# Altium schematic sheet DCDC.SchDoc
size Letter; DocumentNumber: 2; SheetNumber: 2; SheetTotal: 7; DescLong2_DescShort: -
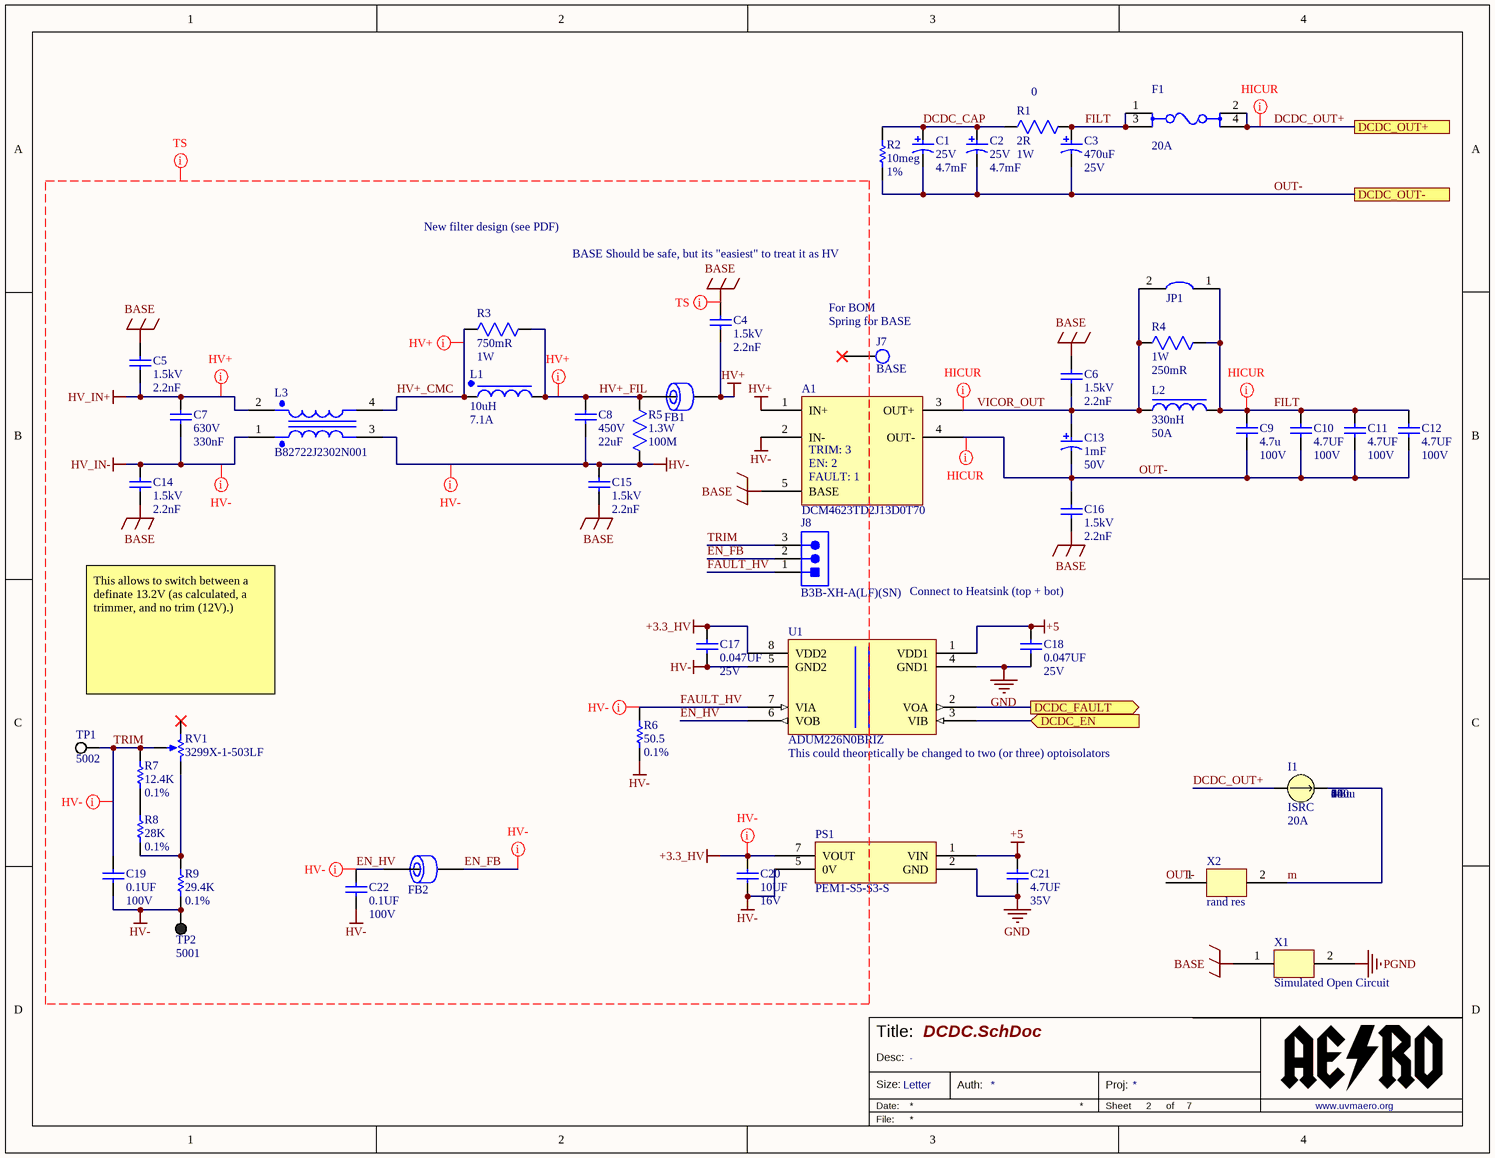
[diagram p0: DCDC.SchDoc]

## Parts
A1  VicorPN: DCM4623TD2J13D0T70  [VICOR_SOCKET_BUILT]  (hidden comment: VicorASM)
C1  Voltage Rating (DC): 25V  Capacitance: 4.7mF  [NICH_18X25]  (hidden comment: URS1E472MHD)
C2  Voltage Rating (DC): 25V  Capacitance: 4.7mF  [NICH_18X25]  (hidden comment: URS1E472MHD)
C3  Capacitance: 470uF  Voltage Rating (DC): 25V  [NICHICON_10X12.5]  (hidden comment: UVR1E471MPD1TD)
C4  Voltage Rating (DC): 1.5kV  Capacitance: 2.2nF  [B32021A3222K000]  (hidden comment: B32021A3222K000)
C5  Voltage Rating (DC): 1.5kV  Capacitance: 2.2nF  [B32021A3222K000]  (hidden comment: B32021A3222K000)
C6  Voltage Rating (DC): 1.5kV  Capacitance: 2.2nF  [B32021A3222K000]  (hidden comment: B32021A3222K000)
C7  Voltage: 630V  Capacitance: 330nF  [B32922C3334M000]  (hidden comment: B32922C3334M000)
C8  Voltage: 450V  Capacitance: 22uF  [B32774D]  (hidden comment: B32774D4226K000)
C9  Val: 4.7u  Vol: 100V  [1210_CAP_115H]  (hidden comment: CAP 1210 4.7UF 100V 20% X7S)
C10  Val: 4.7UF  Vol: 100V  [1210_CAP_115H]  (hidden comment: CAP 1210 4.7UF 100V 20% X7S)
C11  Val: 4.7UF  Vol: 100V  [1210_CAP_115H]  (hidden comment: CAP 1210 4.7UF 100V 20% X7S)
C12  Val: 4.7UF  Vol: 100V  [1210_CAP_115H]  (hidden comment: CAP 1210 4.7UF 100V 20% X7S)
C13  Capacitance: 1mF  Voltage Rating: 50V  [Nichicon_18x20]  (hidden comment: UHE1H102MHD3)
C14  Voltage Rating (DC): 1.5kV  Capacitance: 2.2nF  [B32021A3222K000]  (hidden comment: B32021A3222K000)
C15  Voltage Rating (DC): 1.5kV  Capacitance: 2.2nF  [B32021A3222K000]  (hidden comment: B32021A3222K000)
C16  Voltage Rating (DC): 1.5kV  Capacitance: 2.2nF  [B32021A3222K000]  (hidden comment: B32021A3222K000)
C17  Val: 0.047UF  Vol: 25V  [0603_CAP]  (hidden comment: CAP 0603 0.047UF 25V 10% X7R)
C18  Val: 0.047UF  Vol: 25V  [0603_CAP]  (hidden comment: CAP 0603 0.047UF 25V 10% X7R)
C19  Val: 0.1UF  Vol: 100V  [0805_CAP]  (hidden comment: CAP 0805 0.1UF 100V 10% X7R)
C20  Val: 10UF  Vol: 16V  [0603_CAP]  (hidden comment: CAP 0603 10UF 16V 20% X5R)
C21  Val: 4.7UF  Vol: 35V  [0603_CAP]  (hidden comment: CAP 0603 4.7UF 35V 10% X5R)
C22  Val: 0.1UF  Vol: 100V  [0805_CAP]  (hidden comment: CAP 0805 0.1UF 100V 10% X7R)
F1  FuseRating: 20A  [Keystone_3568_0]  (hidden comment: 3568)
FB1  FBMH4532HM681-T  [1812_FB]  (value not drawn)
FB2  Ferrite Chip 50 Ohms  [1206]  (value not drawn)
I1  ISRC  value 20A  AC Magnitude: 6  AC Phase: 15  DC Magnitude: 14  Pulsed Value: 20  Time Delay: 0  Rise Time: 6u  Fall Time: 0.3u  Pulse Width: 53u  Period: 100u  Phase: 4
J7  BASE  [KSTN240]  (mechanical)
J8  B3B-XH-A(LF)(SN)  [B3B-XH-A(LF)(SN)]
JP1  18AWG Link  [18AWG_1CM_LINK]  (value not drawn)
L1  Inductance: 10uH  Max DC Current: 7.1A  [WE-PD-XXL]  (hidden comment: 7447709100)
L2  Inductance: 330nH  Max DC Current: 50A  [WE-HCM 1390]  (hidden comment: 744309033)
L3  B82722J2302N001  [B82722J]
PS1  PEM1-S5-S3-S  [PEM1-S5-S3-S]
R1  value 0  Resistance: 2R  Power Rating: 1W  [RR01_VERT]  (hidden comment: RR01J2R0TB)
R2  Val: 10meg  Tol: 1%  [0603_RES]  (hidden comment: RES 0603 10M 1%)
R3  Resistance: 750mR  Power Rating: 1W  [RR01_VERT]  (hidden comment: RR01JR75TB)
R4  Power Rating: 1W  Resistance: 250mR  [WSLT2512]  (hidden comment: WSLT2512R2500FEB)
R5  value 100M  Power: 1.3W  [mur_MHR0422SA107F70]  (hidden comment: MHR0422SA107F70)
R6  Val: 50.5  Tol: 0.1%  [0805_RES]  (hidden comment: RES 0805 50.5 0.1%)
R7  Val: 12.4K  Tol: 0.1%  [0603_RES]  (hidden comment: RES 0603 12.4K 0.1%)
R8  Val: 28K  Tol: 0.1%  [0603_RES]  (hidden comment: RES 0603 28K 0.1%)
R9  Val: 29.4K  Tol: 0.1%  [0603_RES]  (hidden comment: RES 0603 29.4K 0.1%)
RV1  3299X-1-503LF  [3296Z]
TP1  5002  [KSTN-5002]
TP2  5001  [KSTN-5001]
U1  ADUM226N0BRIZ  [ADUM226N0BRIZ]
X1  Simulated Open Circuit
X2  rand res

## Ports
DCDC_EN (in), DCDC_FAULT (out), DCDC_OUT+, DCDC_OUT-

## Nets
+3.3_HV: C17.2 C20.2 PS1.7(VOUT) U1.8(VDD2)
+5: C18.2 C21.2 PS1.1(VIN) U1.1(VDD1)
BASE: A1.5(BASE) C4.2 C5.2 C6.2 C14.1 C15.1 C16.1 X1.1
GND: C18.1 C21.1 PS1.2(GND) U1.4(GND1)
HV+: A1.1(IN+) C4.1 FB1.2
HV-: A1.2(IN-) C8.1 C15.2 C17.1 C19.2 C20.1 C22.2 L3.3 PS1.5(0V) R5.1 R6.1 R9.1 TP2.1 U1.5(GND2)
HV_IN+: C5.1 C7.2 L3.2
HV_IN-: C7.1 C14.2 L3.1
PGND: X1.2
DCDC_CAP: C1.1 C2.1 R1.2 R2.2
DCDC_EN: U1.3(VIB) ; port DCDC_EN
DCDC_FAULT: U1.2(VOA) ; port DCDC_FAULT
DCDC_OUT+: F1.2 F1.4 I1.1 ; port DCDC_OUT+
EN_FB: FB2.2 J8.2
EN_HV: C22.1 FB2.1 U1.6(VOB)
FAULT_HV: J8.1 R6.2 U1.7(VIA)
FILT: C3.1 C9.2 C10.2 C11.2 C12.2 F1.1 F1.3 JP1.1 L2.2 R1.1 R4.2
HV+_CMC: L1.1 L3.4 R3.1
HV+_FIL: C8.2 FB1.1 L1.2 R3.2 R5.2
m: I1.2 X2.2
OUT-: A1.4(OUT-) C1.2 C2.2 C3.2 C9.1 C10.1 C11.1 C12.1 C13.2 C16.2 R2.1 X2.1 ; port DCDC_OUT-
TRIM: C19.1 J8.3 R7.2 RV1.2(WIPER) TP1.1
VICOR_OUT: A1.3(OUT+) C6.1 C13.1 JP1.2 L2.1 R4.1
NetR7_1: R7.1 R8.2
NetR8_1: R8.1 R9.2 RV1.1(CCW)

Not connected (* = marked no-connect by the designer): J7 1*; RV1 3(CW)*

## Layout directives
net class TS_H: HV+_CMC, HV+_FIL, HV_IN+
net class TS_L: +3.3_HV, EN_FB, EN_HV, FAULT_HV, HV-, HV_IN-, TRIM
net class TS: +3.3_HV, BASE, EN_FB, EN_HV, FAULT_HV, HV+, HV+_CMC, HV+_FIL, HV-, HV_IN+, HV_IN-, TRIM
net class HICUR: DCDC_OUT+, FILT, OUT-, VICOR_OUT

## Notes on the sheet
- New filter design (see PDF)
- BASE Should be safe, but its "easiest" to treat it as HV
- (near J7) For BOM
- (near J7) Spring for BASE
- Connect to Heatsink (top + bot)
- This allows to switch between a definate 13.2V (as calculated, a trimmer, and no trim (12V).)
- (near U1) This could theoretically be changed to two (or three) optoisolators
- Title:
- Size:
- Date:
- Desc:
- Letter
- Auth:
- Sheet
- Proj:
- *
- of
- www.uvmaero.org
- File:
- (in symbol VicorASM_ALT) TRIM: 3; EN: 2; FAULT: 1

## Library data of the parts
A1 = VicorASM_ALT: DCM4623TD2J13D0T70 PCB Assembly / Keystone 240 for BASE (also order KSTN241) / Do a full subassembly bom check; ComponentLink1Description: Datasheet; ComponentLink1URL: http://www.vicorpower.com/documents/datasheets/DCM4623xD2J13D0y7z_ds.pdf
C1 C2 = URS1E472MHD: 4700µF 25V Aluminum Electrolytic Capacitors Radial, Can  2000 Hrs @ 85°C; Manufacturer: Nichicon; Dielectric Material: Aluminium; Dissipation Factor: 0.16%; Leakage Current: 3.525mA; Life (Hours): 2000Hour; Ripple Current: 2.05A; Tolerance: 20%; Value: 0.0047; ComponentLink1Description: Manufacturer URL; ComponentLink2Description: Datasheet; ComponentLink2URL: http://products.nichicon.co.jp/en/pdf/XJA043/e-ud.pdf; ComponentLink3URL: http://products.nichicon.co.jp/en/pdf/XJA043/e-ud.pdf; ComponentLink3Description: Package Specification; ComponentLink1URL: http://www.nichicon.co.jp/; Case/Package: Radial; Category: Aluminum Electrolytic Capacitors; Diameter: 18mm; Height: 25mm; Height - Seated (Max): 1.043inch; Lead Free: Lead Free; Lead Pitch: 7.5mm; Length: 25mm; Manufacturer Part Number: URS1E472MHD; Max Operating Temperature: 85°C; Min Operating Temperature: -40°C; Mount: Through Hole; Number of Pins: 2; Package Quantity: 50; Packaging: Bulk; Radiation Hardening: No; REACH SVHC: No SVHC; Termination: Radial; Voltage Rating: 25V; Supplier 1: Digi-Key; Supplier Part Number 1: 493-15905-ND
C3 = UVR1E471MPD1TD: 470µF 25V Aluminum Electrolytic Capacitors Radial, Can  2000 Hrs @ 85°C; Manufacturer: Nichicon; Dissipation Factor: 0.16%; Lead Diameter: 0.6mm; Leakage Current: 352.5uA; Life (Hours): 2000Hour; Ripple Current: 550mA; Tolerance: 20%; ComponentLink1Description: Manufacturer URL; ComponentLink2Description: Datasheet; ComponentLink2URL: http://products.nichicon.co.jp/en/pdf/XJA043/e-ud.pdf; ComponentLink3URL: http://products.nichicon.co.jp/en/pdf/XJA043/e-ud.pdf; ComponentLink3Description: Package Specification; ComponentLink1URL: http://www.nichicon.co.jp/; Case/Package: Radial; Category: Aluminum Electrolytic Capacitors; Diameter: 10mm; Height: 12.5mm; Height - Seated (Max): 0.551inch; Lead Pitch: 5mm; Length: 12.5mm; Manufacturer Part Number: UVR1E471MPD1TD; Max Operating Temperature: 85°C; Min Operating Temperature: -40°C; Mount: Through Hole,PCB; Package Quantity: 500; Packaging: Tape and Reel; Radiation Hardening: No; REACH SVHC: No SVHC; Termination: Radial; Voltage: 25V; Voltage Rating: 25V; Supplier 1: Digi-Key; Supplier Part Number 1: UVR1E471MPD1TD-ND
C4-C6 C14-C16 = B32021A3222K000: 2200pF Film Capacitor 300V 1500V (1.5kV) Polypropylene (PP), Metallized Radial; Manufacturer: TDK EPCOS; Lead Diameter: 0.6mm; Lead/Base Style: Straight; Tolerance: 10%; ComponentLink1Description: Datasheet; ComponentLink1URL: http://en.tdk.eu/inf/20/20/db/fc_2009/Y2_B32021_026.pdf; Case/Package: Radial; Category: Film Capacitors; Depth: 4mm; Dielectric: PP; Height: 9mm; Lead Pitch: 10mm; Length: 13mm; Manufacturer Part Number: B32021A3222K000; Max Operating Temperature: 110°C; Min Operating Temperature: -40°C; Number of Pins: 2; Package Quantity: 1000; Packaging: Bulk; Termination: Radial; Voltage Rating (AC): 300V; Width: 4mm
C7 = B32922C3334M000: 0.33µF Film Capacitor 305V 630V Polypropylene (PP) Radial; Manufacturer: TDK EPCOS; Lead Diameter: 0.8mm; Tolerance: 20%; ComponentLink1Description: Datasheet; ComponentLink1URL: http://en.tdk.eu/inf/20/20/db/fc_2009/Y2_B32021_026.pdf; Supplier 1: Digi-Key; Case/Package: Radial; Category: Film Capacitors; Contact Plating: Tin,Matte; Depth: 8mm; Dielectric: PP; Dielectric Material: Polypropylene; Lead Pitch: 15mm; Length: 18mm; Manufacturer Part Number: B32922C3334M000; Max Operating Temperature: 105°C; Min Operating Temperature: -40°C; Mount: Through Hole; Number of Pins: 2; Packaging: Bulk; Radiation Hardening: No; REACH SVHC: No SVHC; Termination: Radial; Voltage Rating (AC): 305V; Width: 18mm; Supplier Part Number 1: 495-2321-ND
C8 = B32774D4226K000: 22µF Film Capacitor  450V Polypropylene (PP), Metallized Radial; Manufacturer: TDK EPCOS; ESR (Equivalent Series Resistance): 5.4mR; Lead Diameter: 0.8mm; Lead Length: 6mm; Tolerance: 10%; Category: Film Capacitors; Contact Plating: Tin,Matte; Depth: 22mm; Dielectric: PP; Dielectric Material: PP; Height: 36.5mm; Lead Pitch: 27.5mm; Length: 31.5mm; Manufacturer Part Number: B32774D4226K000; Max Operating Temperature: 105°C; Min Operating Temperature: -40°C; Mount: Through Hole; Packaging: Bulk; REACH SVHC: No SVHC; Termination: Radial; Voltage Rating: 450V; Voltage Rating (DC): 450V; Supplier 1: Digi-Key; Supplier Part Number 1: 495-3942-ND
C9 = CAP 1210 4.7UF 100V 20% X7S: Capacitor Surface Mount 1210 Footprint 4.7UF 100V 20% Tolerance Ceramic X7S; Manufacturer: Various; PCB Package: 1210; Description in Visual: Cap SMT 1210 4.7UF 100V 20%  Cer X7S; Value: 4.7u; P/N: CAP 1210 4.7UF 100V 20% X7S; Manufacturer P/N: Various; Voltage: 100V; Tolerance: 20%; Type: Ceramic X7S; ComponentLink1Description: Manufacturer Website; ComponentLink2Description: Component Datasheet; ComponentLink3Description: Octopart Link
C10-C12 = CAP 1210 4.7UF 100V 20% X7S: Capacitor Surface Mount 1210 Footprint 4.7UF 100V 20% Tolerance Ceramic X7S; Manufacturer: Various; PCB Package: 1210; Description in Visual: Cap SMT 1210 4.7UF 100V 20%  Cer X7S; P/N: CAP 1210 4.7UF 100V 20% X7S; Manufacturer P/N: Various; Value: 4.7UF; Voltage: 100V; Tolerance: 20%; Type: Ceramic X7S; ComponentLink1Description: Manufacturer Website; ComponentLink2Description: Component Datasheet; ComponentLink3Description: Octopart Link
C13 = UHE1H102MHD3: 1000µF 50V Aluminum Electrolytic Capacitors Radial, Can  10000 Hrs @ 105°C; Manufacturer: Nichicon; Dielectric Material: Aluminium; Dissipation Factor: 0.1%; ESR (Equivalent Series Resistance): 97mR; Impedance: 36mR; Lead Diameter: 0.8mm; Leakage Current: 500uA; Life (Hours): 10000Hour; Ripple Current: 2.49A; Tolerance: 20%; Value: 1m; Voltage Rating (DC): 50V; Case/Package: Radial; Category: Aluminum Electrolytic Capacitors; Diameter: 18mm; Height: 20mm; Height - Seated (Max): 0.787inch; Lead Free: Lead Free; Lead Pitch: 7.5mm; Length: 20mm; Manufacturer Part Number: UHE1H102MHD3; Max Operating Temperature: 105°C; Min Operating Temperature: -40°C; Mount: Through Hole; Package Quantity: 50; Packaging: Bulk; Radiation Hardening: No; REACH SVHC: No SVHC; Termination: Radial; Supplier 1: Digi-Key; Supplier Part Number 1: 493-1623-ND
C17 C18 = CAP 0603 0.047UF 25V 10% X7R: Capacitor Surface Mount 0603 Footprint 0.047UF 25V 10% Tolerance Ceramic X7R; Manufacturer: Various; PCB Package: 0603; Description in Visual: Cap SMT 0603 0.047UF 25V 10%  Cer X7R; P/N: CAP 0603 0.047UF 25V 10% X7R; Manufacturer P/N: Various; Value: 0.047UF; Voltage: 25V; Tolerance: 10%; Type: Ceramic X7R; ComponentLink1Description: Manufacturer Website; ComponentLink2Description: Component Datasheet; ComponentLink3Description: Octopart Link
C19 C22 = CAP 0805 0.1UF 100V 10% X7R: Capacitor Surface Mount 0805 Footprint 0.1UF 100V 10% Tolerance Ceramic X7R; Manufacturer: Various; PCB Package: 0805; Description in Visual: Cap SMT 0805 0.1UF 100V 10%  Cer X7R; P/N: CAP 0805 0.1UF 100V 10% X7R; Manufacturer P/N: Various; Value: 0.1UF; Voltage: 100V; Tolerance: 10%; Type: Ceramic X7R; ComponentLink1Description: Manufacturer Website; ComponentLink2Description: Component Datasheet; ComponentLink3Description: Octopart Link
C20 = CAP 0603 10UF 16V 20% X5R: Capacitor Surface Mount 0603 Footprint 10UF 16V 20% Tolerance Ceramic X5R; Manufacturer: Various; PCB Package: 0603; Description in Visual: Cap SMT 0603 10UF 16V 20% Ceramic X5R; P/N: CAP 0603 10UF 16V 20% X5R; Manufacturer P/N: Various; Value: 10UF; Voltage: 16V; Tolerance: 20%; Type: Ceramic X5R; ComponentLink1Description: Manufacturer Website; ComponentLink2Description: Component Datasheet; ComponentLink3Description: Octopart Link
C21 = CAP 0603 4.7UF 35V 10% X5R: Capacitor Surface Mount 0603 Footprint 47UF 35V 10% Tolerance Ceramic X5R; Manufacturer: Various; PCB Package: 0603; P/N: CAP 0603 4.7UF 35V 10% X5R; Manufacturer P/N: Various; Description in Visual: CAP 0603 4.7UF 35V 10% X5R; Value: 4.7UF; Voltage: 35V; Tolerance: 10%; Type: Ceramic X5R; ComponentLink1Description: Manufacturer Website; ComponentLink2Description: Component Datasheet; ComponentLink3Description: Octopart Link
F1 = 3568: Fuse Holder 30A 500V 1 Circuit Blade Through Hole; Manufacturer: Keystone Electronics; Approvals: UL; Body Material: Nylon; Color: Black; Fuse Type: Automotive; Illumination Type: Illuminated; Material: Brass,Tin,Nylon; Number of Circuits: 1; Value: 0.00321; Category: Fuse Holders; Contact Material: Brass,Tin; Contact Plating: Tin; Current Rating: 20A; Depth: 6.73mm; Flammability Rating: UL94 V-0; Fuse Current: 20A; Lead Free: Lead Free; Length: 16mm; Manufacturer Part Number: 3568; Max Operating Temperature: 145°C; Min Operating Temperature: -50°C; Mount: PCB,Vertical; Number of Poles: 1; Orientation: Vertical; Package Quantity: 1; REACH SVHC: No SVHC; Termination: PC Pin; Voltage: 500V; Voltage Rating (AC): 500V; Supplier 1: Digi-Key; Supplier Part Number 1: 36-3568-ND
FB1 = FBMH4532HM681-T: Ferrite Chip 4000 mA 680 Ohms Differential Mode - Single 1812 Footprint; Manufacturer: Taiyo Yuden; Description in Visual: Ferrite SMT 4000mA 680Ohm Dif Mode 1812; Usage: Power Supply; Current (mA): 5000; Frequency: 100 MHz; Impedance at Freq (ohms): 30; DC Resistance (ohms): 0.028; PCB Package: 1812; P/N: FBMH4532HM681-T; Manufacturer P/N: FBMH4532HM681-T; Filter type: Differential Mode - Single; Operating Temperature Range: -40 to +125 °C; ComponentLink1Description: Manufacturer Website; ComponentLink1URL: #http://www.yuden.co.jp#; ComponentLink2Description: Component Datasheet; ComponentLink2URL: #https://ds.yuden.co.jp/TYCOMPAS/ut/detail?pn=FBMH4532HM681-T%20%20&u=M#; ComponentLink3Description: Octopart Link; ComponentLink3URL: #https://octopart.com/search?q=FBMH4532HM681-T&currency=USD&specs=0#
FB2 = 742792114: Ferrite Chip 3000 mA 50 Ohms Differential Mode - Single 1206 Footprint; Manufacturer: Wurth Electronics; Description in Visual: Ferrite SMT 3000mA 50Ohm Dif Mode 1206; Usage: Power Supply; Current (mA): 3000; Frequency: 100 MHz; Impedance at Freq (ohms): 50; DC Resistance (ohms): 0.02; P/N: 742792114; Manufacturer P/N: 742792114; Filter type: Differential Mode - Single; Operating Temperature Range: -55 to +125 °C; PCB Package: 1206; ComponentLink1Description: Manufacturer Website; ComponentLink1URL: http://www.we-online.com; ComponentLink2Description: Component Datasheet; ComponentLink2URL: http://www.we-online.com/eisos/pdf/742792114.pdf; ComponentLink3Description: Octopart Link; ComponentLink3URL: http://octopart.com/partsearch/#search/requestData&q=742792114
I1 = ISRC: Current Source; Note: PCB Footprint - Not required; Published: 8-Jun-2000; LatestRevisionDate: 17-Jul-2002; LatestRevisionNote: Re-released for DXP Platform.; PackageReference: Not Applicable; Publisher: Altium Limited; Initial Value: 14
J7 = 240: Battery Contact Spring (Coil) AA 1 Cell PC Pin; Supplier 1: Digi-Key; Supplier Part Number 1: 36-240-ND
J8 = B3B-XH-A(LF)(SN): Connector Header Through Hole 3 position 0.098" (2.50mm); Manufacturer: JST; Wire/Cable Gauge: 22AWG; Connector Type: Male Pin; Contact Resistance: 20mR; Current Rating: 3A; Gender: Male; Insulation Resistance: 1GR; Max Voltage Rating (AC): 250V; Number of Contacts: 3; Pitch: 2.5mm; Category: Headers and Wire Housings; Color: Natural; Contact Material: Brass; Contact Plating: Tin,Lead,Copper; Depth: 5.75mm; Fastening Type: Detent; Housing Color: White; Housing Material: Polyamide; Lead Free: Lead Free; Lead Pitch: 2.5mm; Length: 9.9mm; Manufacturer Part Number: B3B-XH-A(LF)(SN); Max Current Rating: 3A; Max Operating Temperature: 85°C; Max Voltage Rating (DC): 250V; Min Operating Temperature: -25°C; Mount: Through Hole; Number of Positions: 3; Number of Rows: 1; Orientation: Straight; Packaging: Bulk; REACH SVHC: No SVHC; Termination: Press-Fit; Voltage Rating: 250V; Voltage Rating (AC): 250V; Supplier 1: Newark; Supplier Part Number 1: 73M9431
JP1 = JP_18AWG: 18AWG Jumper link, 1CM
L1 = 7447709100: 10µH Shielded Wirewound Inductor 7.1A 21mOhm Max Nonstandard; Manufacturer: Wurth Electronics; Core Material: Ferrite; DC Resistance (DCR): 21mR; Inductance Tolerance: 20%; Saturation Current: 10.5A; Self Resonant Frequency: 21MHz; Test Frequency: 1kHz; Case Code (Imperial): 1210; Case Code (Metric): 3225; Case/Package: Nonstandard; Category: Fixed Inductors; Composition: Wirewound; Current Rating: 7.1A; Depth: 12mm; Height: 10mm; Height - Seated (Max): 0.394inch; Lead Free: Lead Free; Lead Pitch: 7mm; Length: 12mm; Manufacturer Part Number: 7447709100; Max Operating Temperature: 125°C; Min Operating Temperature: -40°C; Mount: Surface Mount; Number of Pins: 2; Package Quantity: 250; Packaging: Cut Tape; REACH SVHC: Unknown; Resistance: 21mR; RMS Current (Irms): 7.1A; Series Resistance: 21mR; Shielding: Shielded; Termination: SMD/SMT; Tolerance: 20%; Weight: 0.01lb; Width: 12mm; Supplier 1: Digi-Key; Supplier Part Number 1: 732-1241-1-ND
L2 = 744309033: 330nH Shielded Wirewound Inductor 47.5A 0.165mOhm Nonstandard; Manufacturer: Wurth Electronics; Core Material: Zinc; DC Resistance (DCR): 0.165mR; Inductance Tolerance: 20%; Saturation Current: 62.5A; Self Resonant Frequency: 158MHz; Test Frequency: 100kHz; Width: 0.512inch; Case/Package: Nonstandard; Category: Fixed Inductors; Composition: Wirewound; Current Rating: 47.5A; Height: 9mm; Height - Seated (Max): 0.374inch; Lead Free: Lead Free; Length: 0.551inch; Manufacturer Part Number: 744309033; Max Operating Temperature: 125°C; Min Operating Temperature: -40°C; Mount: Surface Mount; Package Quantity: 300; Packaging: Tape and Reel; REACH SVHC: Unknown; RMS Current (Irms): 50A; Shielding: Shielded; Termination: SMD/SMT; Tolerance: 20%; Supplier 1: Allied Electronics; Supplier Part Number 1: 71071222
L3 = B82722J2302N001: 1.2mH @ 10kHz 2 Line Common Mode Choke Through Hole  3A DCR 56mOhm (Typ); Manufacturer: TDK EPCOS; Approvals: VDE,UR,ENEC; Core Material: Ferrite; DC Resistance (DCR): 56R; Inductance Tolerance: 30%; Lead/Base Style: Pin; Number of Lines: 2; Row Spacing: 12.5mm; Series Resistance: 56mR; Shielding: Unshielded; Voltage Rating (AC): 250V; Case/Package: Radial; Category: Common Mode Chokes; Contact Plating: Tin; Current Rating: 3A; DC Current: 3A; Depth: 16.1mm; Flammability Rating: UL94 V-0; Height: 25.4mm; Inductance: 1.2mH; Lead Free: Lead Free; Lead Pitch: 10mm; Length: 23.3mm; Manufacturer Part Number: B82722J2302N001; Max Current Rating: 3A; Max DC Current: 3A; Max Operating Temperature: 125°C; Military Standard: Not; Min Operating Temperature: -40°C; Mount: Through Hole; Number of Pins: 4; Package Quantity: 540; Packaging: Box; Radiation Hardening: No; REACH SVHC: No SVHC; Termination: Radial; Test Frequency: 10kHz; Tolerance: 30%; Weight: 0.35274oz; Width: 16.1mm; Supplier 1: Digi-Key; Supplier Part Number 1: 495-2748-ND
PS1 = PEM1-S5-S3-S: Isolated Module DC DC Converter 1 Output 3.3V    303mA 4.5V - 5.5V Input; Manufacturer: CUI; Efficiency: 75%; Isolation Voltage: 3kV; Max Power Dissipation: 1W; Number of Outputs: 1; Case/Package: SIP; Category: Board Mount Modules; Features: OVP,OCP,OTP,SCP; Height: 0.37inch; Lead Free: Lead Free; Length: 0.77inch; Manufacturer Part Number: PEM1-S5-S3-S; Max Input Voltage: 5.5V; Max Operating Temperature: 105°C; Max Output Current: 303mA; Min Input Voltage: 4.5V; Min Operating Temperature: -40°C; Mount: Through Hole; Packaging: Rail/Tube; Voltage - Output 1: 3.3V; Width: 0.24inch; Supplier 1: Digi-Key; Supplier Part Number 1: 102-3663-ND
R1 = RR01J2R0TB: 2 Ohms ±5% 1W Through Hole Resistor Axial Flame Retardant Coating, Pulse Withstanding, Safety Metal Film; Manufacturer: TE Connectivity Holsworthy; Manufacturer Part Number: RR01JR75TB; Voltage Rating: 350V; Number of Resistors: 1; Temperature Coefficient: 300ppm/°C; Case/Package: Axial; Category: Through-Hole Resistors; Composition: Power resistor; Diameter: 2.6mm; ELV: Compliant; Length: 6.8mm; Max Operating Temperature: 155°C; Min Operating Temperature: -55°C; Mount: Axial; Number of Terminations: 2; Package Quantity: 5000; Packaging: Ammo Pack; Termination: Axial; Tolerance: 5%; Supplier 1: Digi-Key; Supplier Part Number 1: A138161CT-ND
R2 = RES 0603 10M 1%: Resistor Surface Mount, 10M Ohms, 0603 Footprint, 1% Tolerance 0.1W; Manufacturer: Various; PCB Package: 0603; Description in Visual: Res SMT 10M 0603  1%  0.1W; Value: 10meg; P/N: RES 0603 10M 1%; Manufacturer P/N: Various; Power_Rating: 0.1W; Tolerance: 1%
R3 = RR01JR75TB: 750 mOhms ±5% 1W Through Hole Resistor Axial Flame Retardant Coating, Pulse Withstanding, Safety Metal Film; Manufacturer: TE Connectivity Holsworthy; Voltage Rating: 350V; Number of Resistors: 1; Temperature Coefficient: 300ppm/°C; Case/Package: Axial; Category: Through-Hole Resistors; Composition: Power resistor; Diameter: 2.6mm; ELV: Compliant; Length: 6.8mm; Manufacturer Part Number: RR01JR75TB; Max Operating Temperature: 155°C; Min Operating Temperature: -55°C; Mount: Axial; Number of Terminations: 2; Package Quantity: 5000; Packaging: Ammo Pack; Termination: Axial; Tolerance: 5%; Supplier 1: Digi-Key; Supplier Part Number 1: A138247CT-ND
R4 = WSLT2512R2500FEB: 250 mOhms ±1% 1W Chip Resistor 2512 (6432 Metric) Anti-Sulfur, Automotive AEC-Q200, Current Sense, Moisture Resistant, Pulse Withstanding Metal Element; Manufacturer: Vishay Dale; Temperature Coefficient: 75ppm/°C; Case Code (Imperial): 2512; Case Code (Metric): 6432; Case/Package: 2512; Category: Chip SMD Resistors; Composition: Metal Element; Features: Moisture Resistant; Height: 0.035inch; Length: 0.25inch; Manufacturer Part Number: WSLT2512R2500FEB; Max Operating Temperature: 275°C; Max Power Dissipation: 1W; Min Operating Temperature: -65°C; Number of Terminations: 2; Package Quantity: 1; Packaging: Tape and Reel; Termination: SMD/SMT; Tolerance: 1%; Weight: 0.001429oz; Width: 0.125inch; Supplier 1: Digi-Key; Supplier Part Number 1: WSLTB-.250CT-ND
R5 = MHR0422SA107F70: 100 MOhms ±1% 1.3W Through Hole Resistor Radial High Voltage Thick Film; Manufacturer: Murata; Manufacturer Part Number: MHR0422SA107F70; Supplier 1: Digi-Key; Supplier Part Number 1: 490-18226-ND
R6 = RES 0805 50.5 0.1%: Resistor Surface Mount, 50.5 Ohms, 0805 Footprint, 0.1% Tolerance 0.125W; Manufacturer: Various; PCB Package: 0805; Description in Visual: Res SMT 50.5 0805  0.1%  0.125W; Value: 50.5; P/N: RES 0805 50.5 0.1%; Manufacturer P/N: Various; Power_Rating: 0.125W; Tolerance: 0.1%
R7 = RES 0603 12.4K 0.1%: Resistor Surface Mount, 12.4K Ohms, 0603 Footprint, 0.1% Tolerance 0.1W; Manufacturer: Various; PCB Package: 0603; Description in Visual: Res SMT 12.4K 0603  0.1%  0.1W; P/N: RES 0603 12.4K 0.1%; Manufacturer P/N: Various; Value: 12.4K; Power_Rating: 0.1W; Tolerance: 0.1%
R8 = RES 0603 28K 0.1%: Resistor Surface Mount, 28K Ohms, 0603 Footprint, 0.1% Tolerance 0.1W; Manufacturer: Various; PCB Package: 0603; Description in Visual: Res SMT 28K 0603  0.1%  0.1W; P/N: RES 0603 28K 0.1%; Manufacturer P/N: Various; Value: 28K; Power_Rating: 0.1W; Tolerance: 0.1%
R9 = RES 0603 29.4K 0.1%: Resistor Surface Mount, 29.4K Ohms, 0603 Footprint, 0.1% Tolerance 0.1W; Manufacturer: Various; PCB Package: 0603; Description in Visual: Res SMT 29.4K 0603  0.1%  0.1W; P/N: RES 0603 29.4K 0.1%; Manufacturer P/N: Various; Value: 29.4K; Power_Rating: 0.1W; Tolerance: 0.1%
RV1 = 3299X-1-503LF: 50 kOhms 0.5W, 1/2W PC Pins Through Hole Trimmer Potentiometer Cermet 25 Turn Side Adjustment; Manufacturer: Bourns; Max Power Dissipation: 500mW; Number of Turns: 25; Resistance: 50kR; Temperature Coefficient: 100ppm/°C; Tolerance: 10%; Voltage Rating: 300V; Voltage Rating (DC): 500V; Category: Variable Resistors and Potentiometers; Color: Blue; Composition: Cermet; Depth: 6.1mm; Height: 0.375inch; Lead Free: Lead Free; Length: 11.05mm; Manufacturer Part Number: 3299X-1-503LF; Max Operating Temperature: 125°C; Military Standard: Not; Min Operating Temperature: -55°C; Mount: Panel,Through Hole,PCB; Package Quantity: 50; Packaging: Rail/Tube; Power Rating: 500mW; Radiation Hardening: No; REACH SVHC: No SVHC; Taper: Linear; Termination: Pin; Weight: 0.035oz; Width: 9.53mm; Supplier 1: Digi-Key; Supplier Part Number 1: 3299X-503LF-ND
TP1 = 5002: Test Point, White, 1-Pin THD, RoHS, Bulk; Manufacturer: KeystoneElectronics; Outside Diameter: 2.54mm; Plating: Silver; Mounting Hole Size: 1mm; Product: TestPoints; Packaging: Bulk; Manufacturer URL: http://www.keyelco.com/; Length: 7.62mm; Datasheet Version: Rev. G, 12/2008; Type: Miniature; Product Category: CircuitBoardHardware-PCB; Material: Nylon; RoHS: True; Contact Material: PhosphorBronze; Datasheet URL: https://ciiva.com/datasheet-click-2917627?src=ciiva&sig=bd195616; Color: White; Brand: KeystoneElectronics; Supplier 1: Digi-Key; Supplier Part Number 1: 36-5002-ND
TP2 = 5001: Test Point, Black, 1-Pin THD, RoHS, Bulk; Manufacturer: KeystoneElectronics; Outside Diameter: 2.54mm; Plating: Silver; Mounting Hole Size: 1mm; Product: TestPoints; Packaging: Bulk; Manufacturer URL: http://www.keyelco.com/; Length: 7.62mm; Datasheet Version: Rev. G, 12/2008; Type: Miniature; Product Category: CircuitBoardHardware-PCB; Material: Nylon; RoHS: True; Contact Material: PhosphorBronze; Datasheet URL: https://ciiva.com/datasheet-click-2917627?src=ciiva&sig=bd195616; Color: Black; Brand: KeystoneElectronics; Supplier 1: Digi-Key; Supplier Part Number 1: 36-5001-ND
U1 = ADUM226N0BRIZ: General Purpose Digital Isolator 5000Vrms 2 Channel 150Mbps 75kV/µs CMTI 8-SOIC (0.295", 7.50mm Width); Manufacturer: Analog Devices; Vendor: Analog Devices Inc; Built_By: Analog Devices Inc.; Max Supply Voltage: 5.5V; Min Supply Voltage: 1.7V; Number of Channels: 2; Propagation Delay: 7.2ns; Manufacturer_Part_Number: ADUM226N0BRIZ; Copyright: Copyright (C) 2018 Accelerated Designs. All rights reserved; RefDes: RefDes; Type: DEV; Value: Value; Case/Package: SOIC; Lead Free: Contains Lead; Manufacturer Part Number: ADUM226N0BRIZ; Max Operating Temperature: 125°C; Min Operating Temperature: -40°C; Number of Pins: 8; REACH SVHC: No SVHC
X1 X2 = Generic